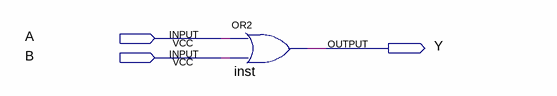
[diagram p0: schematic sheet]
// Quartus schematic OrGate_scheme.bdf as structural Verilog: 1 symbols, 3 pins
module OrGate_scheme (
  input  A,
  input  B,
  output Y
);

  or inst (Y, A, B);
endmodule
